# Altium schematic sheet [1]Shutdown.SchDoc
size A4; SheetNumber: 3; SheetTotal: 6
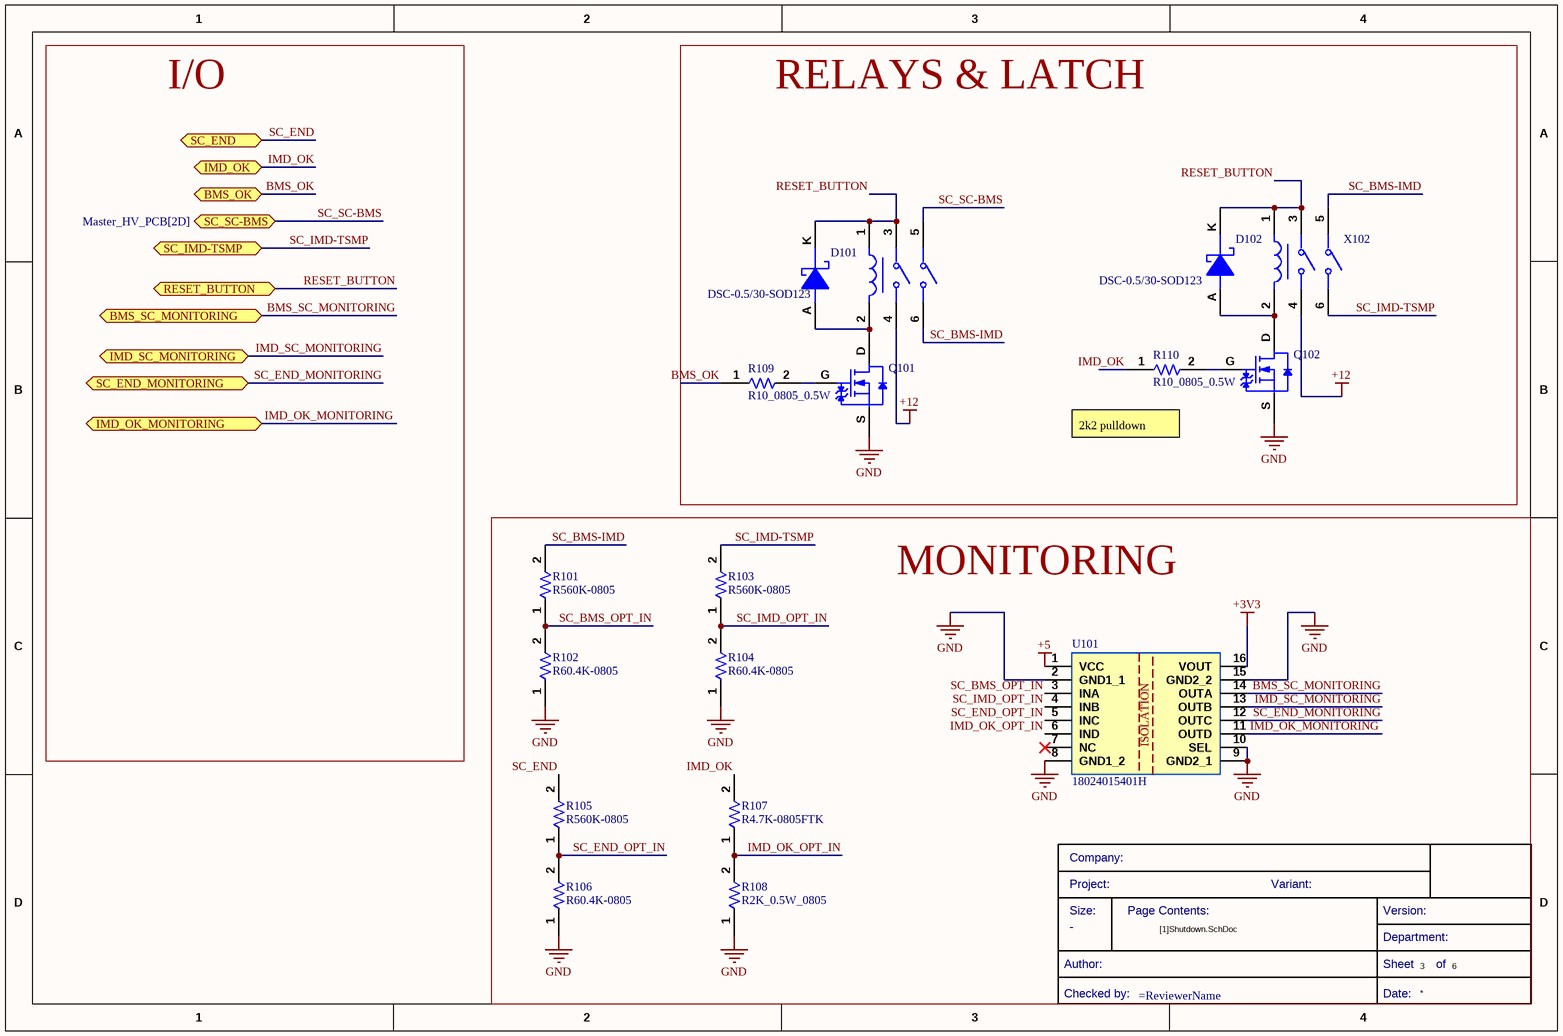
[diagram p0: [1]Shutdown.SchDoc]

## Parts
?  (no value)  (graphical)
D101  DSC-0.5/30-SOD123  [DSC-SOD123]
D102  DSC-0.5/30-SOD123  [DSC-SOD123]
Q101  SQ2318CES-T1_GE3  [SOT95P245X110-3N]  (value not drawn)
Q102  SQ2318CES-T1_GE3  [SOT95P245X110-3N]  (value not drawn)
R101  R560K-0805  [0805]
R102  R60.4K-0805  [FP-CR0805-IPC_A]
R103  R560K-0805  [0805]
R104  R60.4K-0805  [FP-CR0805-IPC_A]
R105  R560K-0805  [0805]
R106  R60.4K-0805  [FP-CR0805-IPC_A]
R107  R4.7K-0805FTK  [R0805FTK]
R108  R2K_0.5W_0805  [0805]
R109  R10_0805_0.5W  [0805]
R110  R10_0805_0.5W  [0805]
U101  18024015401H  [18024015401H]
X101  RTE44012F  [RTE44012F-Footprint-1]  (value not drawn)
X102  RTE44012F  [RTE44012F-Footprint-1]  (value not drawn)

## Blocks framed on the sheet
RELAYS & LATCH: D101 D102 Q101 Q102 R109 R110 X101 X102
MONITORING: ? R101-R108 U101

## Ports
BMS_OK (bidir, see Master_HV_PCB[2D]), BMS_SC_MONITORING (bidir, see Master_HV_PCB[1D]), IMD_OK (bidir, see Master_HV_PCB[2D]), IMD_OK_MONITORING (bidir, see Master_HV_PCB[1D]), IMD_SC_MONITORING (bidir, see Master_HV_PCB[1D]), RESET_BUTTON (bidir, see Master_HV_PCB[2D]), SC_END (bidir, see Master_HV_PCB[2D], [4]Relays_Control[4B]), SC_END_MONITORING (bidir, see Master_HV_PCB[1D]), SC_IMD-TSMP (bidir, see Master_HV_PCB[2D]), SC_SC-BMS (bidir, see Master_HV_PCB[2D])

## Nets
+3V3: U101.16(VOUT)
+5: U101.1(VCC)
+12: X101.4 X102.4
GND: Q101.S Q102.S R102.1 R104.1 R106.1 R108.1 U101.2(GND1_1) U101.8(GND1_2) U101.9(GND2_1) U101.10(SEL) U101.15(GND2_2)
BMS_OK: R109.1 ; port BMS_OK
BMS_SC_MONITORING: U101.14(OUTA) ; port BMS_SC_MONITORING
IMD_OK: R107.2 R110.1 ; port IMD_OK
IMD_OK_MONITORING: U101.11(OUTD) ; port IMD_OK_MONITORING
IMD_OK_OPT_IN: R107.1 R108.2 U101.6(IND)
IMD_SC_MONITORING: U101.13(OUTB) ; port IMD_SC_MONITORING
RESET_BUTTON: D101.K D102.K X101.1 X101.3 X102.1 X102.3 ; port RESET_BUTTON
SC_BMS-IMD: R101.2 X101.6 X102.5
SC_BMS_OPT_IN: R101.1 R102.2 U101.3(INA)
SC_END: R105.2 ; port SC_END
SC_END_MONITORING: U101.12(OUTC) ; port SC_END_MONITORING
SC_END_OPT_IN: R105.1 R106.2 U101.5(INC)
SC_IMD-TSMP: R103.2 X102.6 ; port SC_IMD-TSMP
SC_IMD_OPT_IN: R103.1 R104.2 U101.4(INB)
SC_SC-BMS: X101.5 ; port SC_SC-BMS
NetD101_A: D101.A Q101.D X101.2
NetD102_A: D102.A Q102.D X102.2
NetQ101_G: Q101.G R109.2
NetQ102_G: Q102.G R110.2

Not connected (* = marked no-connect by the designer): U101 7(NC)*

## Notes on the sheet
- I/O
- (near R110) 2k2 pulldown
- Size:
- Company:
- Project:
- Page Contents:
- Variant:
- Version:
- Checked by:
- Author:
- Sheet
- Date:
- Department:
- of
- (in symbol CMP-00200-1) ISOLATION

## Library data of the parts
? = CMP-00043-6: Standard Title Block
D101 D102 = CMP-00165-1: VR=30V IF=500mA 30pF P=410mW; Max Reverse Leakage Current: 130uA; .Creator: GP; Max Reverse Voltage (DC): 30V; Element Configuration: Single; Average Rectified Current: 500mA; Peak Non-Repetitive Surge Current: 5.5A; Polarity: Standard; Forward Voltage: 430mV; ComponentLink10Description: https://datasheet.ciiva.com/910/mbr0530-910518.pdf?src-supplier=Digi-Key; ComponentLink1Description: Datasheet; Category: Diode; ComponentLink3Description: https://datasheet.ciiva.com/30479/0900766b810e2512-30479401.pdf?src-supplier=RSComponents; ComponentLink5Description: https://datasheet.ciiva.com/910/mbr0530-910516.pdf?src-supplier=Digi-Key; Stock 1: 9; Weight: 0.03g; Source: Filter components.SchLib; ComponentLink2Description: Where buy it; Series: -; Mount: Surface Mount; Max Repetitive Reverse Voltage (Vrrm): 30V; Pricing 1: 1=0,34400, 10=0,23900, 100=0,12200, 500=0,10000 (USD); Design Item ID: DSC-0.5/30-SOD123; ComponentLink8Description: https://datasheet.ciiva.com/17318/mbr0530-17318568.pdf?src-supplier=Future+Electronics; Current Rating: 500mA; ComponentLink1URL: *; Length: 2.7mm; Max Reverse Current: 130uA; ComponentLink7URL: https://datasheet.ciiva.com/8300/mbr0530-8300905.pdf?src-supplier=Avnet; ComponentLink9URL: https://datasheet.ciiva.com/15144/getdatasheetpartid-86760-15144598.pdf?src-supplier=Verical; Radiation Hardening: No; Height: 1.03mm; ComponentLink4Description: https://datasheet.ciiva.com/34301/974753-34301826.pdf?src-supplier=Jameco; ComponentLink7Description: https://datasheet.ciiva.com/8300/mbr0530-8300905.pdf?src-supplier=Avnet; Package Quantity: 1; Forward Current: 500mA; ComponentLink5URL: https://datasheet.ciiva.com/910/mbr0530-910516.pdf?src-supplier=Digi-Key; Max Surge Current: 5.5A; Lead Free: Lead Free; ComponentLink2URL: *; Max Forward Surge Current (Ifsm): 5.5A; Output Current: 500mA; Voltage Rating (DC): 30V; Contact Plating: Tin,Matte; RoHS Compliant: Yes; REACH SVHC: No SVHC; ComponentLink10URL: https://datasheet.ciiva.com/910/mbr0530-910518.pdf?src-supplier=Digi-Key; ComponentLink4URL: https://datasheet.ciiva.com/34301/974753-34301826.pdf?src-supplier=Jameco; ComponentLink6URL: https://datasheet.ciiva.com/25931/mbr0530-25931989.pdf?src-supplier=Avnet+Europe; ComponentLink6Description: https://datasheet.ciiva.com/25931/mbr0530-25931989.pdf?src-supplier=Avnet+Europe; Width: 1.6mm; ComponentLink3URL: https://datasheet.ciiva.com/30479/0900766b810e2512-30479401.pdf?src-supplier=RSComponents; ComponentLink9Description: https://datasheet.ciiva.com/15144/getdatasheetpartid-86760-15144598.pdf?src-supplier=Verical; ComponentLink8URL: https://datasheet.ciiva.com/17318/mbr0530-17318568.pdf?src-supplier=Future+Electronics
Q101 Q102 = CMP-013-00002-1: Mosfet, N-channel, 40V, 7A, SOT-23 Rohs Compliant: Yes
R101 R103 R105 = CMP-009-00008-2: Fixed Resistor, Metal Glaze/thick Film, 0.125W, 560000ohm, 150V, 1% +/-Tol, 100ppm/Cel, Surface Mount, 0805; Power: 125mW; Value: 560k; Min Operating Temperature: -55°C; Case/Package: 0805; RoHS Compliant: Yes; Tolerance: 1%; Mounting Technology: Surface Mount; Pins: 2; Max Operating Temperature: 155°C
R102 R104 R106 = CMP-009-00001-1: Fixed Resistor, Metal Glaze/thick Film, 0.125W, 60400ohm, 150V, 1% +/-Tol, 100ppm/Cel, Surface Mount, 0805; Value: 60.4k; Power: 125mW; RoHS Compliant: Yes; Mounting Technology: Surface Mount; Tolerance: 1%; Max Operating Temperature: 155°C; Case/Package: 0805; Min Operating Temperature: -55°C; Pins: 2
R107 = CMP-00102-1: Res Thick Film 0805 4.7K Ohm 5% 1/8W ±200ppm/°C Molded SMD SMD Paper Tape on Plastic Reel; Manufacturer Part Number 1: CR0805-JW-472ELF; Manufacturer 1: Bourns; Max Power Dissipation: 125mW; .Creator: DR; Voltage Rating (DC): 150V; ComponentLink5URL: https://datasheet.ciiva.com/9122/chpreztr-9122814.pdf?src-supplier=Avnet; ComponentLink2URL: https://datasheet.ciiva.com/6560/chpreztr-6560073.pdf?src-supplier=Digi-Key; Depth: 1.25mm; ComponentLink7URL: https://datasheet.ciiva.com/6560/chpreztr-6560075.pdf?src-supplier=Digi-Key; Radiation Hardening: No; ComponentLink5Description: https://datasheet.ciiva.com/9122/chpreztr-9122814.pdf?src-supplier=Avnet; Construction: Rectangular; Case/Package: 0805; Design Item ID: R4.7K-0805FTK; RoHS Compliant: Yes; Min Operating Temperature: -55°C; Height: 0.024inch; ComponentLink1Description: https://datasheet.ciiva.com/5541/chpreztr-5541593.pdf?src-supplier=Mouser; Series: CR0805; Packaging: Tape and Reel; Width: 0.049inch; Stock 1: 3734; ComponentLink3URL: https://datasheet.ciiva.com/6560/chpreztr-6560074.pdf?src-supplier=Digi-Key; ComponentLink4URL: https://datasheet.ciiva.com/30174/159chpreztr-30174252.pdf?src-supplier=Onlinecomponents.com; Value: 4.7k; Military Standard: Not; Tolerance: 5%; Voltage Rating: 150V; ComponentLink6Description: https://datasheet.ciiva.com/22713/691949-22713272.pdf?src-supplier=Element14; REACH SVHC: No SVHC; Package Quantity: 1; Termination: SMD/SMT; ComponentLink1URL: https://datasheet.ciiva.com/5541/chpreztr-5541593.pdf?src-supplier=Mouser; ComponentLink4Description: https://datasheet.ciiva.com/30174/159chpreztr-30174252.pdf?src-supplier=Onlinecomponents.com; Resistor Type: Thick Film; Length: 2mm; Case Code (Metric): 2012; Category: Chip SMD Resistors; Resistance Tolerance: 5%; Thickness: 508um; ComponentLink6URL: https://datasheet.ciiva.com/22713/691949-22713272.pdf?src-supplier=Element14; Features: Moisture Resistant; Power Rating: 125mW; RoHS: Yes; Mount: Surface Mount; ComponentLink7Description: https://datasheet.ciiva.com/6560/chpreztr-6560075.pdf?src-supplier=Digi-Key; Number of Terminations: 2; Source: Passives.SchLib; Temperature Coefficient: 200ppm/°C; Max Operating Temperature: 155°C; ComponentLink3Description: https://datasheet.ciiva.com/6560/chpreztr-6560074.pdf?src-supplier=Digi-Key; ComponentLink2Description: https://datasheet.ciiva.com/6560/chpreztr-6560073.pdf?src-supplier=Digi-Key; Pricing 1: 1=0,05590, 10=0,01670, 25=0,01290, 100=0,00840, 250=0,00830, 500=0,00690, 1000=0,00410 (USD); Contact Plating: Tin
R108 = CMP-009-00027-1: Fixed Resistor, Metal Glaze/thick Film, 0.5W, 2000ohm, 150V, 1% +/-Tol, 100ppm/Cel, Surface Mount, 0805; Part Number: CRCW08052K00FKEAHP; Manufacturer: Vishay; Value: 2k; Power: 500mW; Max Operating Temperature: 155°C; Case/Package: 0805; Mounting Technology: Surface Mount; RoHS Compliant: Yes; Tolerance: 1%; Min Operating Temperature: -55°C; Pins: 2
R109 R110 = CMP-009-00031-1: Fixed Resistor, Metal Glaze/thick Film, 0.5W, 10ohm, 150V, 1% +/-Tol, 100ppm/Cel, Surface Mount, 0805; Power: 500mW; Value: 10; Tolerance: 1%; Max Operating Temperature: 155°C; RoHS Compliant: Yes; Case/Package: 0805; Min Operating Temperature: -55°C; Mounting Technology: Surface Mount; Pins: 2
U101 = CMP-00200-1: Digital Isolator, 4CH, 125DEG C, WSOIC16 Rohs Compliant: Yes
X101 X102 = CMP-00199-1: Power/Signal Relay, 2 Form A, DPST, Momentary, 0.033A (Coil), 12VDC (Coil), 400mW (Coil), 8A (Contact), 30VDC (Contact), DC Input, Random, AC/DC Output, Through Hole-Straight Mount; Sealing: IMMERSION CLEANABLE CASE; Electrical Life: 30000Cycles; Release Time: 6ms; Operate Time: 15ms; Body Length or Diameter: 29mm; Contact AC Max Power Rating R Load: 2000VA@400VAC; Coil Voltage-Nom: 12V; Body Height: 15.7mm; Dielectric Strength Between Open Contacts: 1000Vrms; PCB Hole Count: 8; Reference Standard: UL; Coil Current(DC)-Max: 33mA; Contact Voltage(AC)-Max: 250V; Dielectric Strength Between Coil and Contacts: 5000Vrms; Coil Resistance: 360R; Coil Operate Voltage(DC): 8.4V; Body Breadth: 12.7inch; Contact DC Max Rating R Load: 8A@30VDC; Contact Voltage(DC)-Max: 30V; Contact AC Max Rating R Load: 8A@250VAC; Coil Release Voltage(DC): 1.2V; End Contact Material: Silver; Relay Form: 2 FORM A; Input Switching Control Type: Random; Min Operating Temperature: -40°C; Termination: Solder; Contact/Output Supply Type: AC/DC; Max Operating Temperature: 85°C; Mounting Technology: Through Hole; Contact Current(AC)-Max: 8A; Coil Power: 400mW; Terminal Length: 0.0036inch; Weight: 13g; Coil/Input Supply Type: DC; RoHS Compliant: Yes; Pins: 8; Relay Function: DPST; Packaging: Box; Contact Current(DC)-Max: 8A; Relay Action: MOMENTARY; Coil Voltage(DC)-Max: 12V; Relay Type: POWER/SIGNAL RELAY; Reach SVHC Compliant: Yes